# EAGLE design Black_PSI_Backpack (EAGLE 9.1.2)
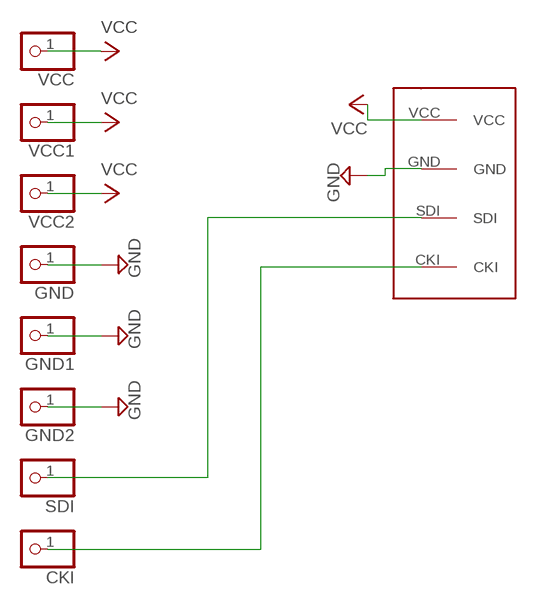
[diagram p0: schematic, sheet 1]

## Parts
CKI  PINHD-1X1  [1X01]
GND  PINHD-1X1  [1X01]
GND1  PINHD-1X1  [1X01]
GND2  PINHD-1X1  [1X01]
SDI  PINHD-1X1  [1X01]
U$1  0393570004WIRE-TO-BOARD  [0393570004WIRE-TO-BOARD]
VCC  PINHD-1X1  [1X01]
VCC1  PINHD-1X1  [1X01]
VCC2  PINHD-1X1  [1X01]

## Nets
CKI: CKI.1 U$1.CKI
GND: GND1.1 GND2.1 GND.1 U$1.GND
SDI: SDI.1 U$1.SDI
VCC: U$1.VCC VCC1.1 VCC2.1 VCC.1

## Library data of the parts
CKI GND GND1 GND2 SDI VCC VCC1 VCC2 = adafruit:PINHD-1X1: Pin header 1x1 for 0.1" spacing With round pins
U$1 = R2-PSI:0393570004WIRE-TO-BOARD

## Board
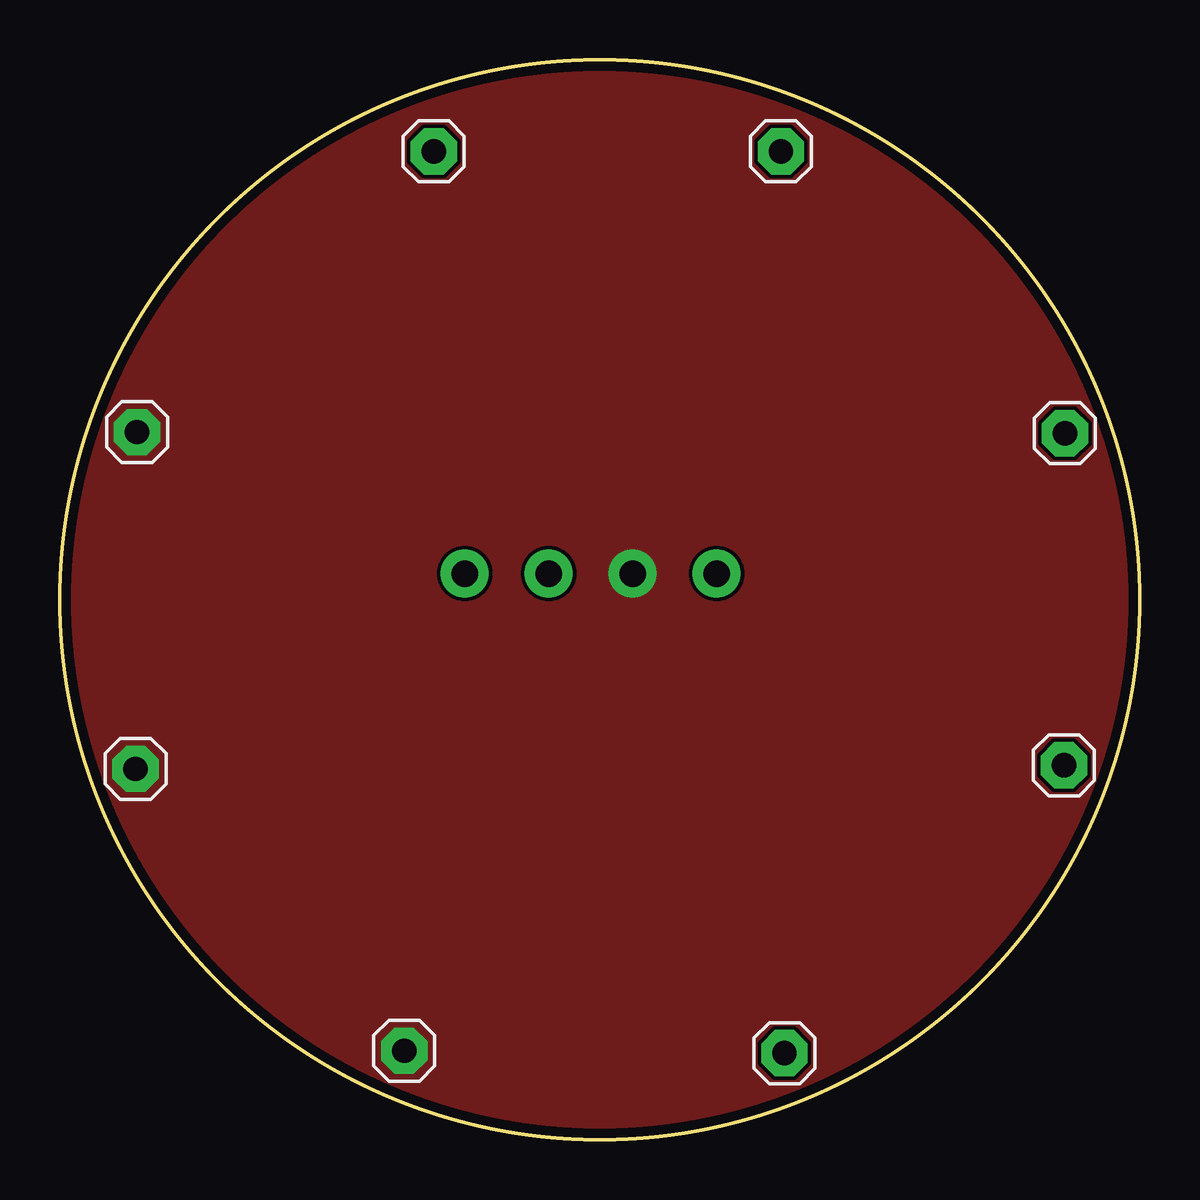
[diagram p1: board, top side]
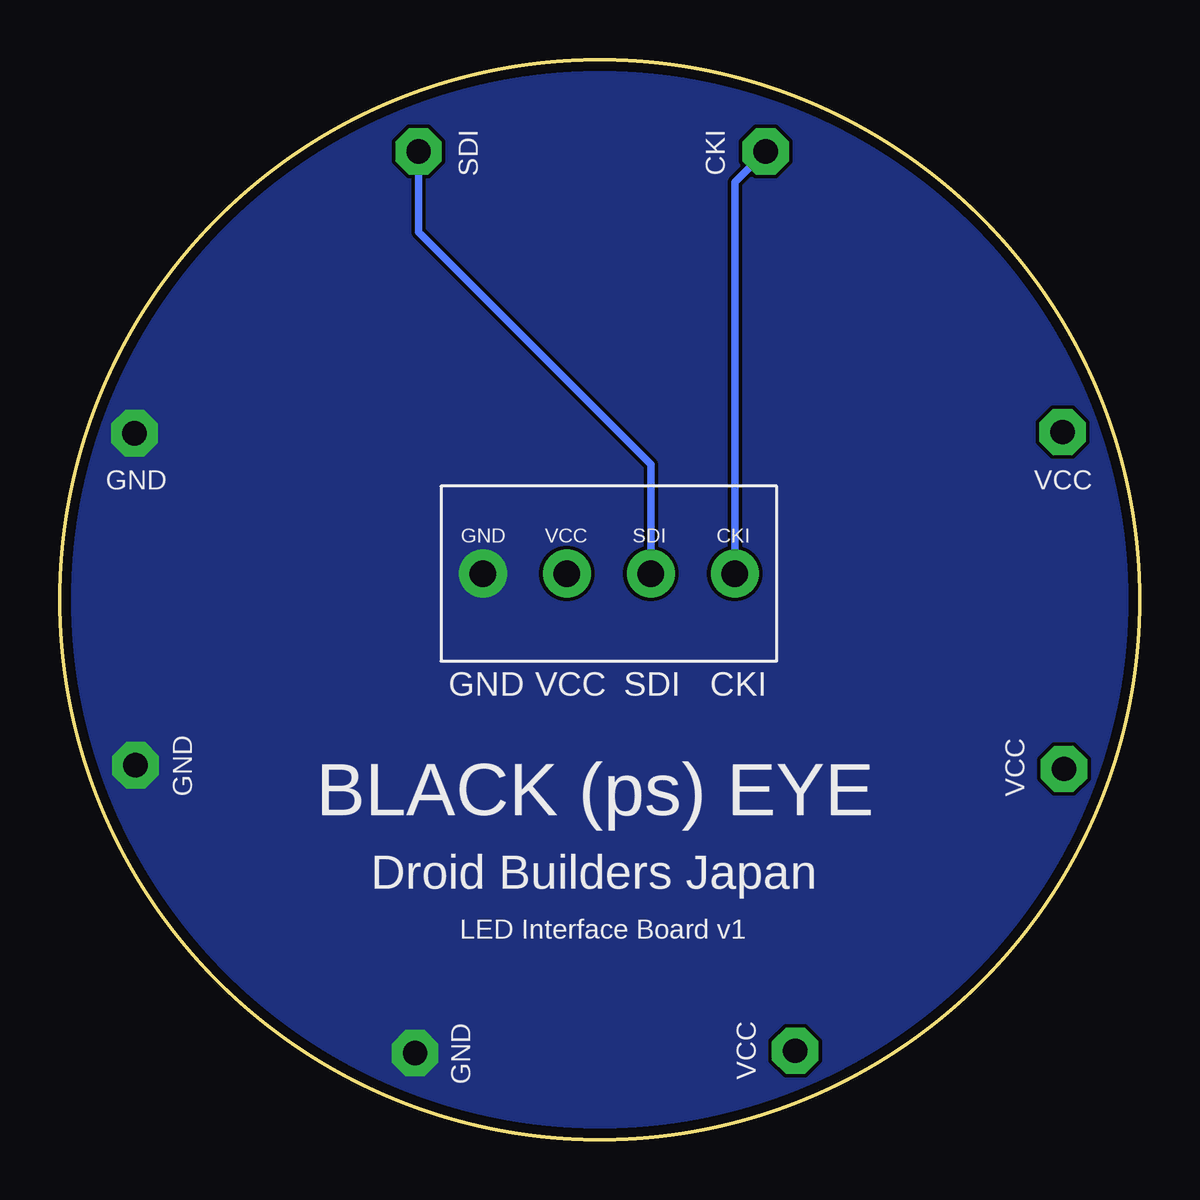
[diagram p2: board, bottom side, seen from below]

Size 45 x 45 mm. Coordinates in mm from the lower left corner, seen from the top.
Outline: circle at 22.5,22.5 radius 22.5
Copper layers (1*16): Top 0.035559375mm / dielectric 1.6mm / Bottom 0.035559375mm
Design rules "oshpark-2layer *": minimum track width 6mil, minimum drill 10mil, track to track 6mil, track to pad 6mil, pad to pad 6mil, via to via 6mil, smd to smd 6mil, copper to edge 15mil, drill to drill 6mil, minimum pad ring 5mil, minimum via ring 5mil, stop-mask expansion 2.5mil, vias tented up to drill 0mil, thermal gap 0mil

### Footprints (pad centres in the part's own frame; a part is rotated, then mirrored left to right if it is on the bottom)
1X01 = drill 1.016 pad 1.93 octagon: 1 0,0
0393570004WIRE-TO-BOARD = drill 1.1 pad 2: CKI -5.25,0; GND 5.25,0; SDI -1.75,0; VCC 1.75,0

### Placement (x,y rotation side)
CKI  15.58,41.19 0 top
GND  30.2,3.6 0 top
GND1  41.89,29.44 0 top
GND2  41.85,15.6 0 top
SDI  30.05,41.19 0 top
U$1  22.12,23.59 180 bottom
VCC  3.21,29.49 0 top
VCC1  3.15,15.45 0 top
VCC2  14.35,3.7 0 top

### Tracks (layer width: path | path; a pad name or v marks a point on that pad's centre or on a via)
CKI
  Bottom 0.305: U$1.CKI 16.87,39.9 CKI.1
GND
  pour Bottom: 0,22.5 arc180 45,22.5 arc180
SDI
  Bottom 0.305: SDI.1 30.05,37.83 20.37,28.14 U$1.SDI
VCC
  pour Top: 0,22.5 arc180 45,22.5 arc180

### Text on the board
bPlace: CKI | SDI | VCC | GND | CKI | SDI | VCC | GND | VCC | GND | BLACK (ps) EYE | Droid Builders Japan | LED Interface Board v1 | VCC | GND